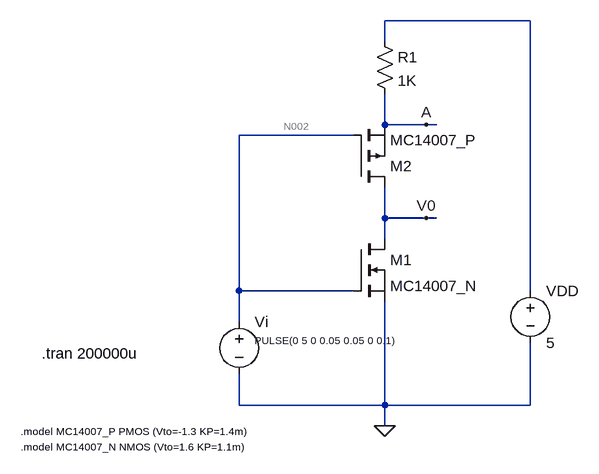
[diagram p0: schematic 1.3.2.asc]
1.3.2.asc, the LTspice schematic file:
Version 4
SHEET 1 880 680
WIRE 544 -272 320 -272
WIRE 320 -240 320 -272
WIRE 320 -112 320 -160
WIRE 384 -112 320 -112
WIRE 400 -112 384 -112
WIRE 272 -96 96 -96
WIRE 320 32 320 -16
WIRE 384 32 320 32
WIRE 400 32 384 32
WIRE 320 64 320 32
WIRE 96 144 96 -96
WIRE 272 144 96 144
WIRE 544 144 544 -272
WIRE 96 192 96 144
WIRE 96 320 96 272
WIRE 320 320 320 160
WIRE 320 320 96 320
WIRE 544 320 544 224
WIRE 544 320 320 320
WIRE 320 352 320 320
FLAG 320 352 0
FLAG 384 -112 A
FLAG 384 32 V0
SYMBOL voltage 96 176 R0
WINDOW 123 0 0 Left 0
WINDOW 39 0 0 Left 0
WINDOW 3 24 44 Left 1
SYMATTR Value PULSE(0 5 0 0.05 0.05 0 0.1)
SYMATTR InstName Vi
SYMBOL nmos 272 64 R0
SYMATTR InstName M1
SYMATTR Value MC14007_N
SYMBOL res 304 -256 R0
SYMATTR InstName R1
SYMATTR Value 1K
SYMBOL voltage 544 128 R0
WINDOW 123 0 0 Left 0
WINDOW 39 0 0 Left 0
SYMATTR InstName VDD
SYMATTR Value 5
SYMBOL pmos 272 -16 M180
SYMATTR InstName M2
SYMATTR Value MC14007_P
TEXT -240 360 Left 1 !.model MC14007_P PMOS (Vto=-1.3 KP=1.4m)
TEXT -240 384 Left 1 !.model MC14007_N NMOS (Vto=1.6 KP=1.1m)
TEXT -208 240 Left 2 !.tran 200000u

The netlist it stands for:
* 1.3.2.asc
Vi N002 0 PULSE(0 5 0 0.05 0.05 0 0.1)
M1 V0 N002 0 0 MC14007_N
R1 N001 A 1K
VDD N001 0 5
M2 V0 N002 A A MC14007_P
.model NMOS NMOS
.model PMOS PMOS
.lib standard.mos
.model MC14007_P PMOS (Vto=-1.3 KP=1.4m)
.model MC14007_N NMOS (Vto=1.6 KP=1.1m)
.tran 200000u
.backanno
.end

* Results of the author's LTspice run, read from the files saved beside the schematic
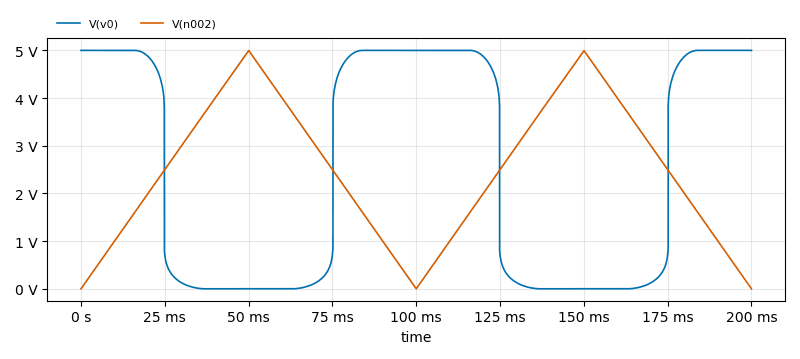
[diagram p1: Transient Analysis of 1.3.2.asc, plotted from the saved traces]
* Transient Analysis, 1 run:
*   V(v0): min 0 V, max 5 V, average 2.478 V, rms 3.466 V, last 5 V
*   V(n002): min 0 V, max 4.997 V, average 2.499 V, rms 2.92 V, last 0 V